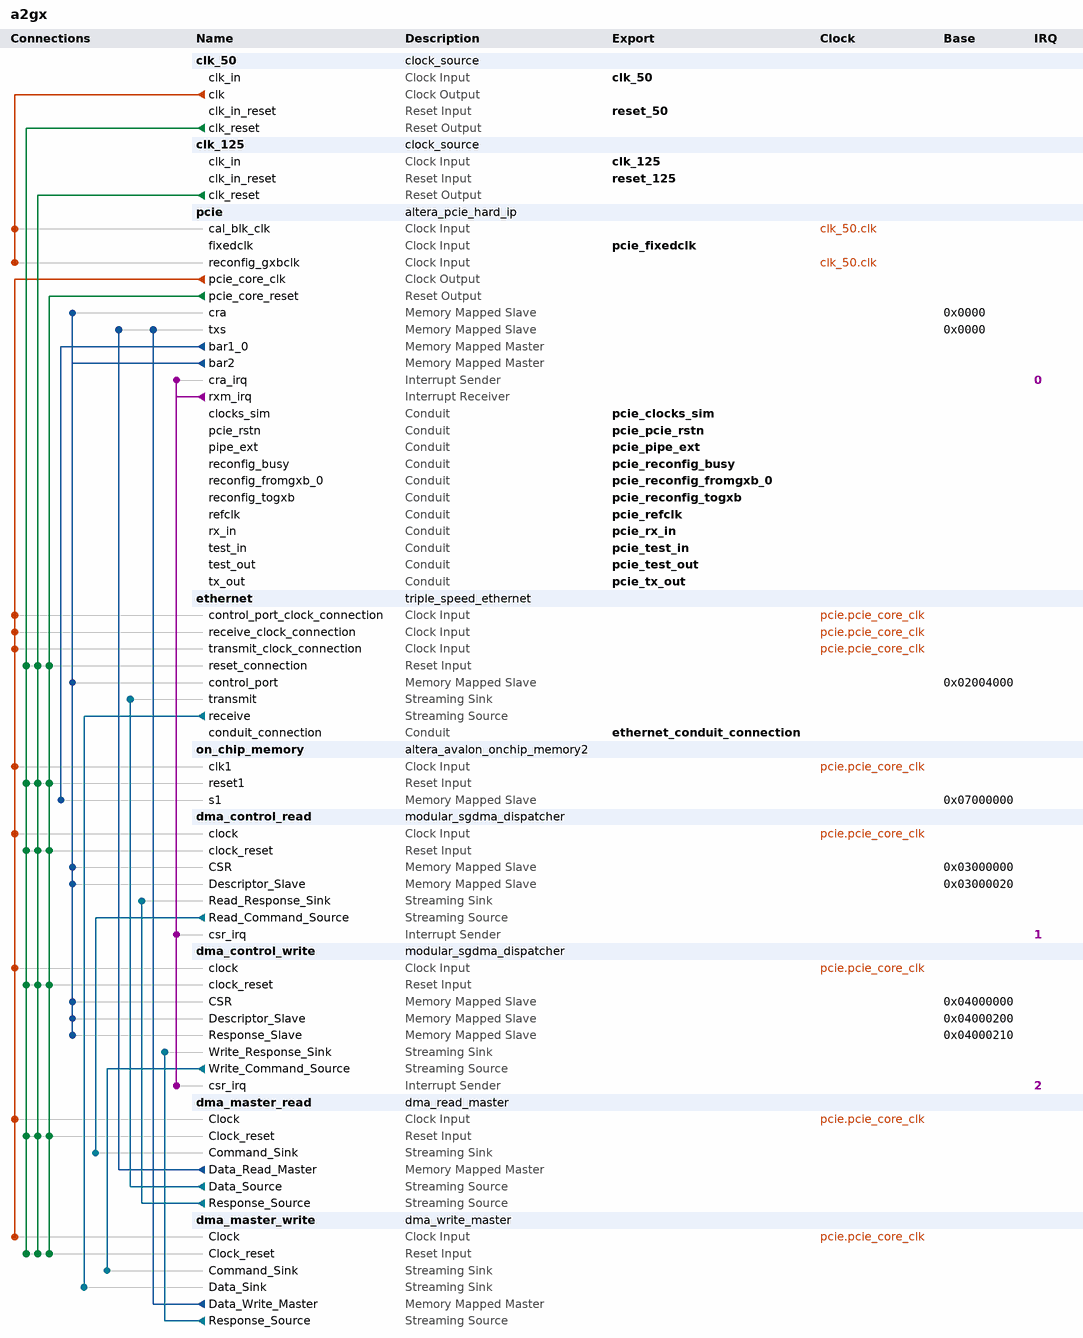
[diagram p0: system contents]
# Platform Designer (Qsys) system a2gx, Arria II GX EP2AGX260FF35I3
# Parameters at their usual value, and those the tool derives, are not listed.
package require -exact qsys 12.1
create_system a2gx
set_project_property DEVICE_FAMILY {Arria II GX}
set_project_property DEVICE EP2AGX260FF35I3

add_instance clk_50 clock_source 12.1
set_instance_parameter_value clk_50 clockFrequency 50000000

add_instance clk_125 clock_source 12.1
set_instance_parameter_value clk_125 clockFrequency 125000000

add_instance pcie altera_pcie_hard_ip 12.1
set_instance_parameter_value pcie max_link_width 4
set_instance_parameter_value pcie p_pcie_test_out_width 64bits
set_instance_parameter_value pcie {BAR Type} {64 bit Prefetchable,Not used,32 bit Non-Prefetchable,Not used,Not used,Not used}
set_instance_parameter_value pcie vendor_id 4466
set_instance_parameter_value pcie device_id 6534
set_instance_parameter_value pcie class_code 2
set_instance_parameter_value pcie subsystem_vendor_id 4466
set_instance_parameter_value pcie subsystem_device_id 5139
set_instance_parameter_value pcie my_advanced_errors false
set_instance_parameter_value pcie my_enable_ecrc_check false
set_instance_parameter_value pcie my_enable_ecrc_gen false
set_instance_parameter_value pcie max_payload_size 1
set_instance_parameter_value pcie CG_NO_CPL_REORDERING 0
set_instance_parameter_value pcie CG_ENABLE_A2P_INTERRUPT 0
set_instance_parameter_value pcie CB_A2P_ADDR_MAP_IS_FIXED 0
set_instance_parameter_value pcie CB_A2P_ADDR_MAP_NUM_ENTRIES 2
set_instance_parameter_value pcie CB_A2P_ADDR_MAP_PASS_THRU_BITS 24
set_instance_parameter_value pcie {PCIe Address 63:32} 0x00000000,0x00000000,0x00000000,0x00000000,0x00000000,0x00000000,0x00000000,0x00000000,0x00000000,0x00000000,0x00000000,0x00000000,0x00000000,0x00000000,0x00000000,0x00000000
set_instance_parameter_value pcie {PCIe Address 31:0} 0x00000000,0x00000000,0x00000000,0x00000000,0x00000000,0x00000000,0x00000000,0x00000000,0x00000000,0x00000000,0x00000000,0x00000000,0x00000000,0x00000000,0x00000000,0x00000000

add_instance ethernet triple_speed_ethernet 12.1
set_instance_parameter_value ethernet atlanticSinkClockRate 0
set_instance_parameter_value ethernet atlanticSinkClockSource unassigned
set_instance_parameter_value ethernet atlanticSourceClockRate 0
set_instance_parameter_value ethernet atlanticSourceClockSource unassigned
set_instance_parameter_value ethernet avalonSlaveClockRate 0
set_instance_parameter_value ethernet avalonSlaveClockSource unassigned
set_instance_parameter_value ethernet avalonStNeighbours {unassigned=unassigned}
set_instance_parameter_value ethernet channel_count 1
set_instance_parameter_value ethernet core_variation MAC_ONLY
set_instance_parameter_value ethernet core_version 3073
set_instance_parameter_value ethernet crc32check16bit 0
set_instance_parameter_value ethernet crc32dwidth 8
set_instance_parameter_value ethernet crc32gendelay 6
set_instance_parameter_value ethernet crc32s1l2_extern false
set_instance_parameter_value ethernet cust_version 0
set_instance_parameter_value ethernet dataBitsPerSymbol 8
set_instance_parameter_value ethernet dev_version 3073
set_instance_parameter_value ethernet eg_addr 11
set_instance_parameter_value ethernet ena_hash false
set_instance_parameter_value ethernet enable_alt_reconfig false
set_instance_parameter_value ethernet enable_clk_sharing false
set_instance_parameter_value ethernet enable_ena 32
set_instance_parameter_value ethernet enable_fifoless false
set_instance_parameter_value ethernet enable_gmii_loopback false
set_instance_parameter_value ethernet enable_hd_logic false
set_instance_parameter_value ethernet enable_mac_flow_ctrl false
set_instance_parameter_value ethernet enable_mac_txaddr_set true
set_instance_parameter_value ethernet enable_mac_vlan false
set_instance_parameter_value ethernet enable_maclite false
set_instance_parameter_value ethernet enable_magic_detect true
set_instance_parameter_value ethernet enable_multi_channel false
set_instance_parameter_value ethernet enable_pkt_class true
set_instance_parameter_value ethernet enable_pma false
set_instance_parameter_value ethernet enable_ptp_1step false
set_instance_parameter_value ethernet enable_reg_sharing false
set_instance_parameter_value ethernet enable_sgmii false
set_instance_parameter_value ethernet enable_shift16 false
set_instance_parameter_value ethernet enable_sup_addr false
set_instance_parameter_value ethernet enable_timestamping false
set_instance_parameter_value ethernet enable_use_internal_fifo true
set_instance_parameter_value ethernet export_calblkclk false
set_instance_parameter_value ethernet export_pwrdn false
set_instance_parameter_value ethernet ext_stat_cnt_ena false
set_instance_parameter_value ethernet gigeAdvanceMode true
set_instance_parameter_value ethernet ifGMII RGMII
set_instance_parameter_value ethernet ifPCSuseEmbeddedSerdes false
set_instance_parameter_value ethernet ing_addr 11
set_instance_parameter_value ethernet insert_ta true
set_instance_parameter_value ethernet maclite_gige false
set_instance_parameter_value ethernet max_channels 1
set_instance_parameter_value ethernet mdio_clk_div 50
set_instance_parameter_value ethernet phy_identifier 0
set_instance_parameter_value ethernet ramType AUTO
set_instance_parameter_value ethernet reset_level 1
set_instance_parameter_value ethernet starting_channel_number 0
set_instance_parameter_value ethernet stat_cnt_ena true
set_instance_parameter_value ethernet timingAdapterName timingAdapter
set_instance_parameter_value ethernet toolContext SOPC_BUILDER
set_instance_parameter_value ethernet transceiver_type GXB
set_instance_parameter_value ethernet tstamp_fp_width 4
set_instance_parameter_value ethernet uiHostClockFrequency 0
set_instance_parameter_value ethernet uiMDIOFreq {0.0 MHz}
set_instance_parameter_value ethernet useLvds false
set_instance_parameter_value ethernet useMAC true
set_instance_parameter_value ethernet useMDIO true
set_instance_parameter_value ethernet usePCS false
set_instance_parameter_value ethernet use_sync_reset true

add_instance on_chip_memory altera_avalon_onchip_memory2 12.1
set_instance_parameter_value on_chip_memory dataWidth 64
set_instance_parameter_value on_chip_memory dualPort false
set_instance_parameter_value on_chip_memory initMemContent false
set_instance_parameter_value on_chip_memory initializationFileName on_chip_memory
set_instance_parameter_value on_chip_memory memorySize 262144

add_instance dma_control_read modular_sgdma_dispatcher 1.0
set_instance_parameter_value dma_control_read MODE 1
set_instance_parameter_value dma_control_read GUI_RESPONSE_PORT 0
set_instance_parameter_value dma_control_read DESCRIPTOR_FIFO_DEPTH 256
set_instance_parameter_value dma_control_read ENHANCED_FEATURES 0
set_instance_parameter_value dma_control_read CSR_ADDRESS_WIDTH 3

add_instance dma_control_write modular_sgdma_dispatcher 1.0
set_instance_parameter_value dma_control_write MODE 2
set_instance_parameter_value dma_control_write GUI_RESPONSE_PORT 0
set_instance_parameter_value dma_control_write DESCRIPTOR_FIFO_DEPTH 256
set_instance_parameter_value dma_control_write ENHANCED_FEATURES 0
set_instance_parameter_value dma_control_write CSR_ADDRESS_WIDTH 3

add_instance dma_master_read dma_read_master 1.0
set_instance_parameter_value dma_master_read DATA_WIDTH 32
set_instance_parameter_value dma_master_read LENGTH_WIDTH 25
set_instance_parameter_value dma_master_read FIFO_DEPTH 256
set_instance_parameter_value dma_master_read STRIDE_ENABLE 0
set_instance_parameter_value dma_master_read GUI_STRIDE_WIDTH 1
set_instance_parameter_value dma_master_read BURST_ENABLE 1
set_instance_parameter_value dma_master_read GUI_MAX_BURST_COUNT 32
set_instance_parameter_value dma_master_read GUI_PROGRAMMABLE_BURST_ENABLE 0
set_instance_parameter_value dma_master_read GUI_BURST_WRAPPING_SUPPORT 1
set_instance_parameter_value dma_master_read TRANSFER_TYPE {Full Word Accesses Only}
set_instance_parameter_value dma_master_read PACKET_ENABLE 1
set_instance_parameter_value dma_master_read ERROR_ENABLE 1
set_instance_parameter_value dma_master_read ERROR_WIDTH 1
set_instance_parameter_value dma_master_read CHANNEL_ENABLE 0
set_instance_parameter_value dma_master_read CHANNEL_WIDTH 8
set_instance_parameter_value dma_master_read ADDRESS_WIDTH 25
set_instance_parameter_value dma_master_read FIFO_SPEED_OPTIMIZATION 1

add_instance dma_master_write dma_write_master 1.0
set_instance_parameter_value dma_master_write DATA_WIDTH 32
set_instance_parameter_value dma_master_write LENGTH_WIDTH 25
set_instance_parameter_value dma_master_write FIFO_DEPTH 256
set_instance_parameter_value dma_master_write STRIDE_ENABLE 0
set_instance_parameter_value dma_master_write GUI_STRIDE_WIDTH 1
set_instance_parameter_value dma_master_write BURST_ENABLE 1
set_instance_parameter_value dma_master_write GUI_MAX_BURST_COUNT 32
set_instance_parameter_value dma_master_write GUI_PROGRAMMABLE_BURST_ENABLE 0
set_instance_parameter_value dma_master_write GUI_BURST_WRAPPING_SUPPORT 1
set_instance_parameter_value dma_master_write TRANSFER_TYPE {Full Word Accesses Only}
set_instance_parameter_value dma_master_write PACKET_ENABLE 1
set_instance_parameter_value dma_master_write ERROR_ENABLE 1
set_instance_parameter_value dma_master_write ERROR_WIDTH 6
set_instance_parameter_value dma_master_write ADDRESS_WIDTH 25
set_instance_parameter_value dma_master_write FIFO_SPEED_OPTIMIZATION 1

# connections
add_connection clk_50.clk pcie.cal_blk_clk clock
add_connection clk_50.clk pcie.reconfig_gxbclk clock
add_connection pcie.pcie_core_clk dma_control_read.clock clock
add_connection pcie.pcie_core_clk dma_control_write.clock clock
add_connection pcie.pcie_core_clk dma_master_read.Clock clock
add_connection pcie.pcie_core_clk dma_master_write.Clock clock
add_connection pcie.pcie_core_clk ethernet.control_port_clock_connection clock
add_connection pcie.pcie_core_clk ethernet.receive_clock_connection clock
add_connection pcie.pcie_core_clk ethernet.transmit_clock_connection clock
add_connection pcie.pcie_core_clk on_chip_memory.clk1 clock
add_connection clk_50.clk_reset dma_control_read.clock_reset reset
add_connection clk_50.clk_reset dma_control_write.clock_reset reset
add_connection clk_50.clk_reset dma_master_read.Clock_reset reset
add_connection clk_50.clk_reset dma_master_write.Clock_reset reset
add_connection clk_50.clk_reset ethernet.reset_connection reset
add_connection clk_50.clk_reset on_chip_memory.reset1 reset
add_connection clk_125.clk_reset dma_control_read.clock_reset reset
add_connection clk_125.clk_reset dma_control_write.clock_reset reset
add_connection clk_125.clk_reset dma_master_read.Clock_reset reset
add_connection clk_125.clk_reset dma_master_write.Clock_reset reset
add_connection clk_125.clk_reset ethernet.reset_connection reset
add_connection clk_125.clk_reset on_chip_memory.reset1 reset
add_connection pcie.pcie_core_reset dma_control_read.clock_reset reset
add_connection pcie.pcie_core_reset dma_control_write.clock_reset reset
add_connection pcie.pcie_core_reset dma_master_read.Clock_reset reset
add_connection pcie.pcie_core_reset dma_master_write.Clock_reset reset
add_connection pcie.pcie_core_reset ethernet.reset_connection reset
add_connection pcie.pcie_core_reset on_chip_memory.reset1 reset
add_connection dma_master_read.Data_Read_Master pcie.txs avalon
set_connection_parameter_value dma_master_read.Data_Read_Master/pcie.txs baseAddress 0x0000
add_connection dma_master_write.Data_Write_Master pcie.txs avalon
set_connection_parameter_value dma_master_write.Data_Write_Master/pcie.txs baseAddress 0x0000
add_connection pcie.bar1_0 on_chip_memory.s1 avalon
set_connection_parameter_value pcie.bar1_0/on_chip_memory.s1 baseAddress 0x07000000
add_connection pcie.bar2 dma_control_read.CSR avalon
set_connection_parameter_value pcie.bar2/dma_control_read.CSR baseAddress 0x03000000
add_connection pcie.bar2 dma_control_read.Descriptor_Slave avalon
set_connection_parameter_value pcie.bar2/dma_control_read.Descriptor_Slave baseAddress 0x03000020
add_connection pcie.bar2 dma_control_write.CSR avalon
set_connection_parameter_value pcie.bar2/dma_control_write.CSR baseAddress 0x04000000
add_connection pcie.bar2 dma_control_write.Descriptor_Slave avalon
set_connection_parameter_value pcie.bar2/dma_control_write.Descriptor_Slave baseAddress 0x04000200
add_connection pcie.bar2 dma_control_write.Response_Slave avalon
set_connection_parameter_value pcie.bar2/dma_control_write.Response_Slave baseAddress 0x04000210
add_connection pcie.bar2 ethernet.control_port avalon
set_connection_parameter_value pcie.bar2/ethernet.control_port baseAddress 0x02004000
add_connection pcie.bar2 pcie.cra avalon
set_connection_parameter_value pcie.bar2/pcie.cra baseAddress 0x0000
add_connection dma_control_read.Read_Command_Source dma_master_read.Command_Sink avalon_streaming
add_connection dma_control_write.Write_Command_Source dma_master_write.Command_Sink avalon_streaming
add_connection dma_master_read.Data_Source ethernet.transmit avalon_streaming
add_connection dma_master_read.Response_Source dma_control_read.Read_Response_Sink avalon_streaming
add_connection dma_master_write.Response_Source dma_control_write.Write_Response_Sink avalon_streaming
add_connection ethernet.receive dma_master_write.Data_Sink avalon_streaming
add_connection pcie.rxm_irq dma_control_read.csr_irq interrupt
set_connection_parameter_value pcie.rxm_irq/dma_control_read.csr_irq irqNumber 1
add_connection pcie.rxm_irq dma_control_write.csr_irq interrupt
set_connection_parameter_value pcie.rxm_irq/dma_control_write.csr_irq irqNumber 2
add_connection pcie.rxm_irq pcie.cra_irq interrupt
set_connection_parameter_value pcie.rxm_irq/pcie.cra_irq irqNumber 0

# exported interfaces
add_interface reset_50 reset sink
set_interface_property reset_50 EXPORT_OF clk_50.clk_in_reset
add_interface clk_125 clock sink
set_interface_property clk_125 EXPORT_OF clk_125.clk_in
add_interface reset_125 reset sink
set_interface_property reset_125 EXPORT_OF clk_125.clk_in_reset
add_interface pcie_refclk conduit end
set_interface_property pcie_refclk EXPORT_OF pcie.refclk
add_interface pcie_test_in conduit end
set_interface_property pcie_test_in EXPORT_OF pcie.test_in
add_interface pcie_pcie_rstn conduit end
set_interface_property pcie_pcie_rstn EXPORT_OF pcie.pcie_rstn
add_interface pcie_clocks_sim conduit end
set_interface_property pcie_clocks_sim EXPORT_OF pcie.clocks_sim
add_interface pcie_reconfig_busy conduit end
set_interface_property pcie_reconfig_busy EXPORT_OF pcie.reconfig_busy
add_interface pcie_pipe_ext conduit end
set_interface_property pcie_pipe_ext EXPORT_OF pcie.pipe_ext
add_interface pcie_test_out conduit end
set_interface_property pcie_test_out EXPORT_OF pcie.test_out
add_interface pcie_rx_in conduit end
set_interface_property pcie_rx_in EXPORT_OF pcie.rx_in
add_interface pcie_tx_out conduit end
set_interface_property pcie_tx_out EXPORT_OF pcie.tx_out
add_interface pcie_reconfig_togxb conduit end
set_interface_property pcie_reconfig_togxb EXPORT_OF pcie.reconfig_togxb
add_interface pcie_reconfig_fromgxb_0 conduit end
set_interface_property pcie_reconfig_fromgxb_0 EXPORT_OF pcie.reconfig_fromgxb_0
add_interface pcie_fixedclk clock sink
set_interface_property pcie_fixedclk EXPORT_OF pcie.fixedclk
add_interface clk_50 clock sink
set_interface_property clk_50 EXPORT_OF clk_50.clk_in
add_interface ethernet_conduit_connection conduit end
set_interface_property ethernet_conduit_connection EXPORT_OF ethernet.conduit_connection

save_system a2gx.qsys
